# Altium project Oryecto_test.PrjPcb
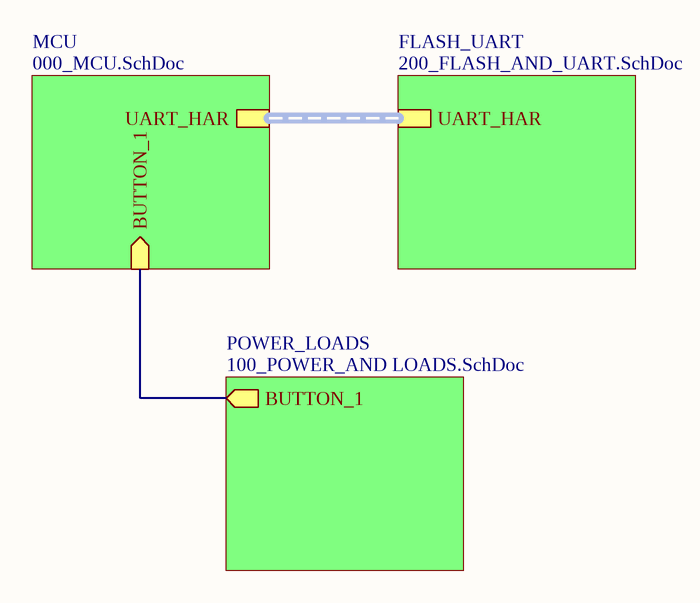
[diagram p0: Main.SchDoc]
4 sheets, 39 parts. Net scope: hierarchical (ports join the sheet entries above them; power ports are global).
Board file: PCB_proyect.PcbDoc
Sheets:
  Main.SchDoc
    MCU = 000_MCU.SchDoc
    POWER_LOADS = 100_POWER_AND LOADS.SchDoc
    FLASH_UART = 200_FLASH_AND_UART.SchDoc

## Sheet Main.SchDoc
size A; SheetNumber: 1; SheetTotal: 4

### Sub-sheets
FLASH_UART = 200_FLASH_AND_UART.SchDoc: UART_HAR (harness UART_HAR)
MCU = 000_MCU.SchDoc: UART_HAR (harness UART_HAR), BUTTON_1 (in)
POWER_LOADS = 100_POWER_AND LOADS.SchDoc: BUTTON_1 (out)

### Nets
NetC109_1: sheet MCU/BUTTON_1, sheet POWER_LOADS/BUTTON_1

### Buses and harness runs
harness sheet FLASH_UART/UART_HAR = sheet MCU/UART_HAR

## Sheet 000_MCU.SchDoc
size A3; Organization: ORGANIZATION; Address1: ADDRESS 1; Address2: ADDRESS 2; Address3: ADDRESS 3; Address4: ADDRESS 4; Revision: -; SheetNumber: 4; SheetTotal: 4; ENG_APP_DATE: --/--/--; DSN_APP_DATE: --/--/--; CHK_APP_DATE: --/--/--
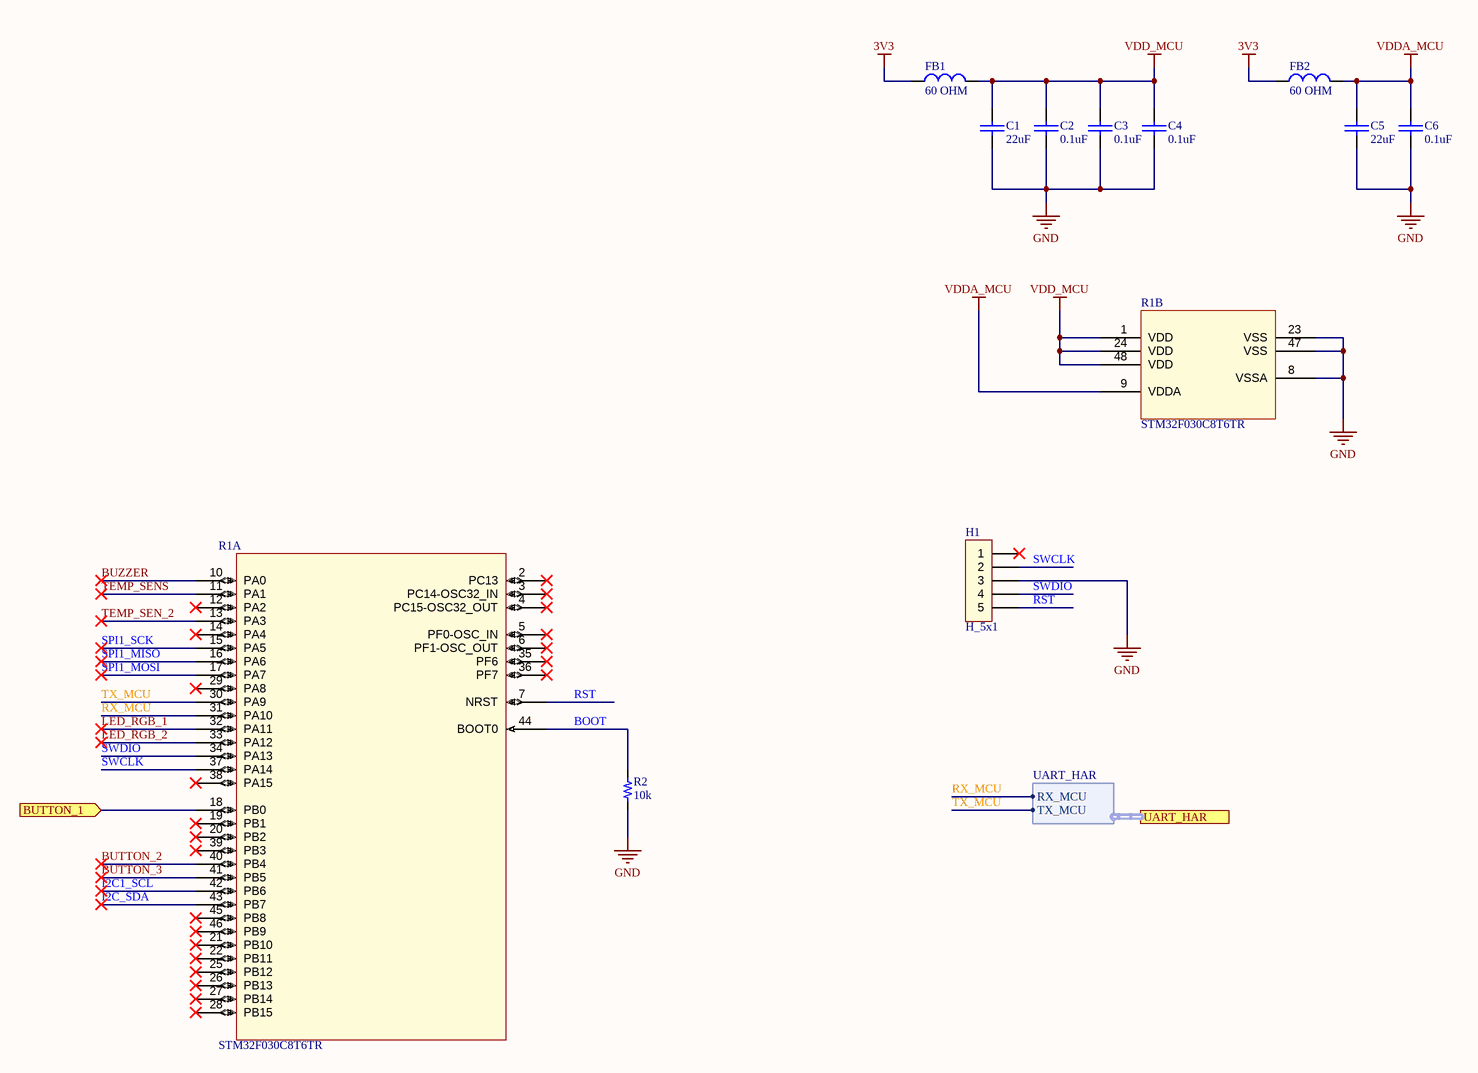
[diagram p1: 000_MCU.SchDoc]

### Parts
C1  value 22uF  [0603_cap]  (hidden comment: 22uF 6V3)
C2  value 0.1uF  [0603_cap]  (hidden comment: 0.1uF 50V)
C3  value 0.1uF  [0603_cap]  (hidden comment: 0.1uF 50V)
C4  value 0.1uF  [0603_cap]  (hidden comment: 0.1uF 50V)
C5  value 22uF  [0603_cap]  (hidden comment: 22uF 6V3)
C6  value 0.1uF  [0603_cap]  (hidden comment: 0.1uF 50V)
FB1  value 60 OHM  [0603_fb]  (hidden comment: 60OHM 2A)
FB2  value 60 OHM  [0603_fb]  (hidden comment: 60OHM 2A)
H1  H_5x1  [H_5x1_TH_100mil]  (no BOM)
R1  STM32F030C8T6TR  [LQFP48_7x7mm]  (parts A,B of 2)
R2  value 10k  [0603_res]  (hidden comment: 10k 1/10W)

### Ports
BUTTON_1 (in, see Main[2B], 100_POWER_AND LOADS[1D]), UART_HAR (harness UART_HAR, see Main[2A], 200_FLASH_AND_UART[3C])

### Harnesses
UART_HAR: RX_MCU, TX_MCU

### Nets
3V3: FB1.1 FB2.1
GND: C1.2 C2.2 C3.2 C4.2 C5.2 C6.2 H1.3 R1.8(VSSA) R1.23(VSS) R1.47(VSS) R2.1
VDD_MCU: C1.1 C2.1 C3.1 C4.1 FB1.2 R1.1(VDD) R1.24(VDD) R1.48(VDD)
VDDA_MCU: C5.1 C6.1 FB2.2 R1.9(VDDA)
BOOT: R1.44(BOOT0) R2.2
BUTTON_2: R1.40(PB4)
BUTTON_3: R1.41(PB5)
BUZZER: R1.10(PA0)
I2C1_SCL: R1.42(PB6)
I2C_SDA: R1.43(PB7)
LED_RGB_1: R1.32(PA11)
LED_RGB_2: R1.33(PA12)
RST: H1.5 R1.7(NRST)
RX_MCU: R1.31(PA10) ; port UART_HAR.RX_MCU
SPI1_MISO: R1.16(PA6)
SPI1_MOSI: R1.17(PA7)
SPI1_SCK: R1.15(PA5)
SWCLK: H1.2 R1.37(PA14)
SWDIO: H1.4 R1.34(PA13)
TEMP_SEN_2: R1.13(PA3)
TEMP_SENS: R1.11(PA1)
TX_MCU: R1.30(PA9) ; port UART_HAR.TX_MCU
NetC109_1: R1.18(PB0) ; port BUTTON_1

Not connected (* = marked no-connect by the designer): H1 1*; R1 2(PC13)* 3(PC14-OSC32_IN)* 4(PC15-OSC32_OUT)* 5(PF0-OSC_IN)* 6(PF1-OSC_OUT)* 12(PA2)* 14(PA4)* 19(PB1)* 20(PB2)* 21(PB10)* 22(PB11)* 25(PB12)* 26(PB13)* 27(PB14)* 28(PB15)* 29(PA8)* 35(PF6)* 36(PF7)* 38(PA15)* 39(PB3)* 45(PB8)* 46(PB9)*

### Notes on the sheet
- DWG. NO.
- REV.
- SHT.
- THIS DOCUMENT AND THE DATA DISCLOSED HEREIN OR HEREWITH IS THE PROPERTY OF ALTIUM LIMITED AND MAY BE FREELY DISTRIBUTED IN WHOLE. NO RIGHTS ARE RESERVED OR EXPRESS OR IMPLIED WARANTEE GIVEN.
- REVISION
- DESCRIPTION
- DATE
- APPROVED
- ENG:
- APPROVALS
- PROJECT
- DSN:
- CHK:
- REFERENCE DOCUMENTS
- PROJECT REVISION:
- TITLE
- DOCUMENT REVISION:
- DESIGN ITEM:
- BOM:
- FAB DWG:
- PCB DWG:
- ASSY DWG:
- SCALE:
- SIZE
- B
- CAGE CODE
- FILE NAME
- DWG NO.
- SHEET
- OF
- REV

### Library data of the parts
C1 C5 = Cap_22uF_0805_6V3: 6.3V 22uF X5R ±20% 0805 Multilayer Ceramic Capacitors MLCC - SMD/SMT ROHS; Manufacturer: Samsung Electro-Mechanics; Manufacturer Part Number: CL21A226MQQNNNE; Supplier 1: LCSC; Supplier Part Number 1: C5674; ComponentLink1Description: LCSC; ComponentLink1URL: https://www.lcsc.com/product-detail/Multilayer-Ceramic-Capacitors-MLCC-SMD-SMT_Samsung-Electro-Mechanics-CL21A226MQQNNNE_C5674.html
C2-C4 C6 = Cap_0.1uF_0603_50V: 50V 100nF Y5V -20%~+80% 0603 Multilayer Ceramic Capacitors MLCC - SMD/SMT ROHS; Manufacturer: Walsin Tech Corp; Manufacturer Part Number: 0603F104Z500CT; Supplier 1: LCSC; Supplier Part Number 1: C83060; ComponentLink1Description: LCSC; ComponentLink1URL: https://www.lcsc.com/product-detail/Multilayer-Ceramic-Capacitors-MLCC-SMD-SMT_Walsin-Tech-Corp-0603F104Z500CT_C83060.html
FB1 FB2 = FB_60_0603_2A: 2A 1 100mΩ 60Ω@100MHz ±25% 0603 Ferrite Beads ROHS; Manufacturer: TAI-TECH; Manufacturer Part Number: HCB1608KF-600T20; ComponentLink1Description: LCSC; ComponentLink1URL: https://www.lcsc.com/product-detail/Ferrite-Beads_TAI-TECH-HCB1608KF-600T20_C369516.html; Supplier 1: LCSC; Supplier Part Number 1: C369516
H1 = H_Male_5x1_TH_100mil: Debugging male pin; Last modified by: C-A.Serna.A; Last modified date: 20190225
R1 = IC_STM32F030C8T6TR_LQFP48_7x7MM: IC MCU 32BIT 64KB FLASH 48LQFP; Manufacturer: STMicroelectronics; Manufacturer part number: STM32F030C8T6TR; Supplier 1: LCSC; Supplier Part Number 1: C23922; ComponentLink1Description: LCSC; ComponentLink1URL: https://www.lcsc.com/product-detail/ST-Microelectronics_STMicroelectronics-STM32F030C8T6_C23922.html
R2 = Res_10k_0603_1/10W: RES SMD 10k OHM 5% 1/10W 0603; Manufacturer: FOJAN; Manufacturer Part Number: FRC0603J103TS; ComponentLink1URL: https://www.lcsc.com/product-detail/Chip-Resistor-Surface-Mount_FOJAN-FRC0603J103TS_C2930027.html; Supplier 1: LCSC; Supplier Part Number 1: C2930027; ComponentLink1Description: LCSC

## Sheet 100_POWER_AND LOADS.SchDoc
size A; SheetNumber: 2; SheetTotal: 4
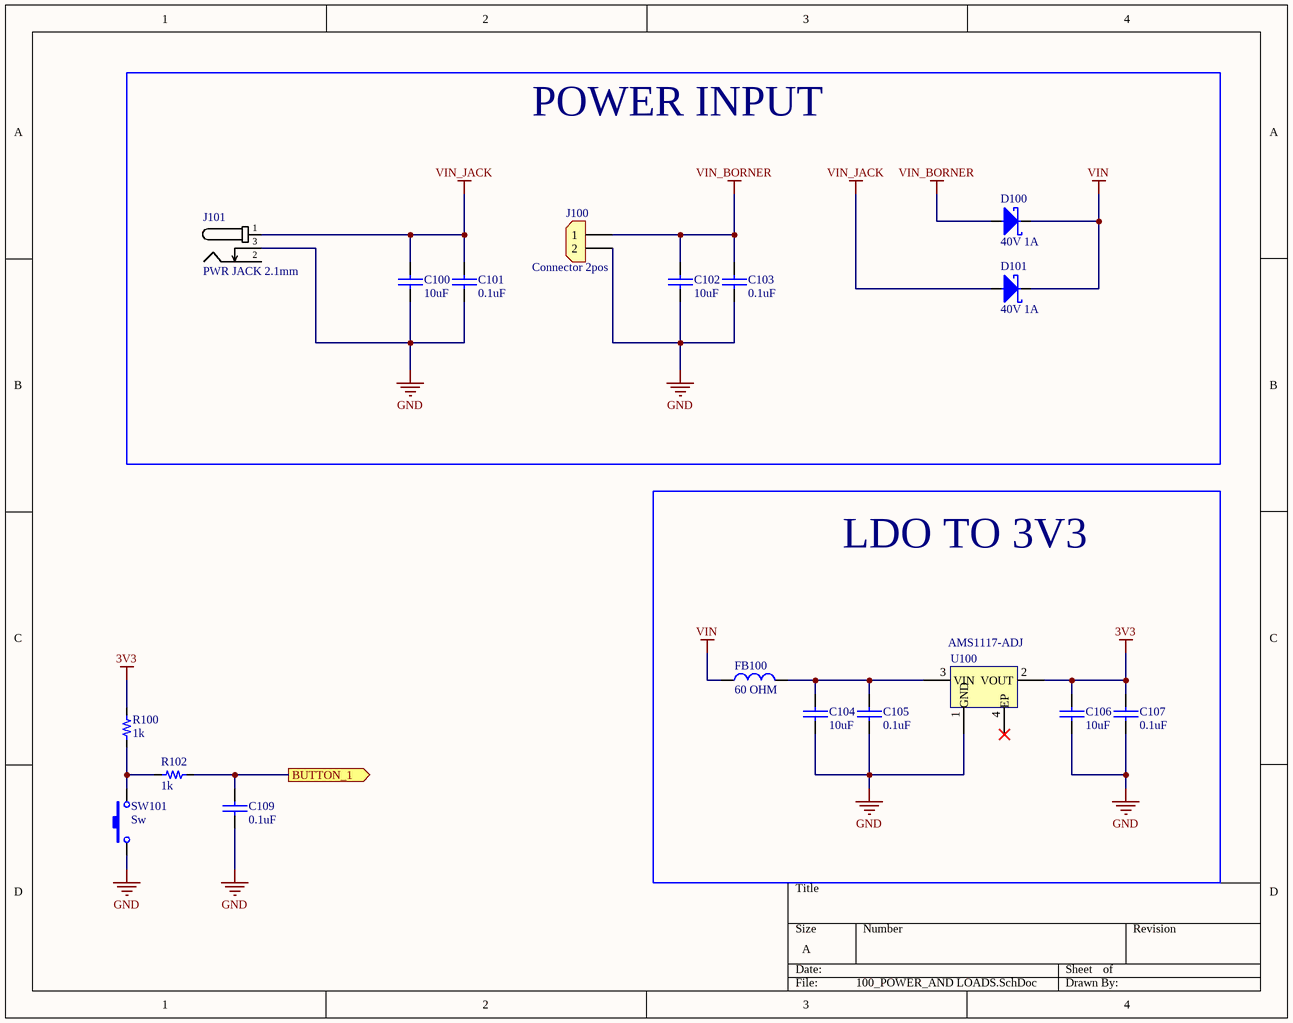
[diagram p2: 100_POWER_AND LOADS.SchDoc]

### Parts
C100  value 10uF  [0603_cap]  (hidden comment: 10uF 10V)
C101  value 0.1uF  [0603_cap]  (hidden comment: 0.1uF 50V)
C102  value 10uF  [0603_cap]  (hidden comment: 10uF 10V)
C103  value 0.1uF  [0603_cap]  (hidden comment: 0.1uF 50V)
C104  value 10uF  [0603_cap]  (hidden comment: 10uF 10V)
C105  value 0.1uF  [0603_cap]  (hidden comment: 0.1uF 50V)
C106  value 10uF  [0603_cap]  (hidden comment: 10uF 10V)
C107  value 0.1uF  [0603_cap]  (hidden comment: 0.1uF 50V)
C109  value 0.1uF  [0603_cap]  (hidden comment: 0.1uF 50V)
D100  40V 1A  [SOD_123]
D101  40V 1A  [SOD_123]
FB100  value 60 OHM  [0603_fb]  (hidden comment: 60OHM 2A)
J100  Connector 2pos  [CON_2x1_TH_5MM]
J101  PWR JACK 2.1mm  [CON_POWER_BARREL_2.1MM_3CONN]
R100  value 1k  [0603_res]  (hidden comment: 1k 1/10W)
R102  value 1k  [0603_res]  (hidden comment: 1k 1/10W)
SW101  Sw  [Sw_PUSH_4.5x4.5x5mm]
U100  AMS1117-ADJ  [SOT_223]

### Blocks framed on the sheet
POWER INPUT: C100-C103 D100 D101 J100 J101
LDO TO 3V3: C104-C107 FB100 U100

### Ports
BUTTON_1 (out, see Main[2B], 000_MCU[2C])

### Nets
3V3: C106.1 C107.1 R100.1 U100.2(VOUT)
GND: C100.2 C101.2 C102.2 C103.2 C104.2 C105.2 C106.2 C107.2 C109.2 J100.2 J101.3 SW101.1 U100.1(GND)
VIN: D100.1 D101.1 FB100.1
VIN_BORNER: C102.1 C103.1 D100.2 J100.1
VIN_JACK: C100.1 C101.1 D101.2 J101.1
NetC104_1: C104.1 C105.1 FB100.2 U100.3(VIN)
NetC109_1: C109.1 R102.2 ; port BUTTON_1
NetR100_2: R100.2 R102.1 SW101.2

Not connected (* = marked no-connect by the designer): J101 2; U100 4(EP)*

### Library data of the parts
C100 C102 C104 C106 = Cap_10uF_0603_10V: 10V 10uF X5R ±10% 0603 Multilayer Ceramic Capacitors MLCC - SMD/SMT ROHS; Manufacturer: CCTC; Manufacturer Part Number: TCC0603X5R106K100CT; Supplier 1: LCSC; Supplier Part Number 1: C380314; ComponentLink1Description: LCSC; ComponentLink1URL: https://www.lcsc.com/product-detail/Multilayer-Ceramic-Capacitors-MLCC-SMD-SMT_CCTC-TCC0603X5R106K100CT_C380314.html
C101 C103 C105 C107 = Cap_0.1uF_0603_50V: as C2 on sheet 000_MCU; Supplier 1: LCSC; Supplier Part Number 1: C83060; ComponentLink1Description: LCSC; ComponentLink1URL: https://www.lcsc.com/product-detail/Multilayer-Ceramic-Capacitors-MLCC-SMD-SMT_Walsin-Tech-Corp-0603F104Z500CT_C83060.html
C109 = Cap_0.1uF_0603_50V: 50V 100nF Y5V -20%~+80% 0603 Multilayer Ceramic Capacitors MLCC - SMD/SMT ROHS; Manufacturer: Walsin Tech Corp; Manufacturer Part Number: 0603F104Z500CT; Usage: NM; Supplier 1: LCSC; Supplier Part Number 1: C83060; ComponentLink1Description: LCSC; ComponentLink1URL: https://www.lcsc.com/product-detail/Multilayer-Ceramic-Capacitors-MLCC-SMD-SMT_Walsin-Tech-Corp-0603F104Z500CT_C83060.html
D100 D101 = D_Schottky_40V_1A_SOD_123F: DIODE SCHOTTKY 40V 1A SOD123F; Manufacturer: Shanghai Prisemi Elec; Manufacturer Part Number: PSBD1DF40V1H; Supplier 1: LCSC; Supplier Part Number 1: C110730; ComponentLink1Description: LCSC; ComponentLink1URL: https://www.lcsc.com/product-detail/Switching-Diode_Shanghai-Prisemi-Elec-PSBD1DF40V1H_C110730.html
FB100 = FB_60_0603_2A: as FB1 on sheet 000_MCU; ComponentLink1Description: LCSC; ComponentLink1URL: https://www.lcsc.com/product-detail/Ferrite-Beads_TAI-TECH-HCB1608KF-600T20_C369516.html; Supplier 1: LCSC; Supplier Part Number 1: C369516
J100 = Con_2x1_TH_5mm: 2POS 5MM; Manufacturer: JILN; Manufacturer Part Number: JL126-50002G01; Supplier 1: LCSC; Supplier Part Number 1: C394556; ComponentLink1Description: Digi-Key; ComponentLink1URL: https://www.lcsc.com/product-detail/Screw-terminal_JILN-JL126-50002G01_C394556.html
J101 = Con_Power_Jack_2.1mm_3pins: CONN PWR JACK 2X5.5MM SOLDER; Manufacturer: HCTL; Manufacturer Part Number: HC-DC-005-2.0T; Supplier 1: LCSC; Supplier Part Number 1: C3010533; ComponentLink1Description: LCSC; ComponentLink1URL: https://www.lcsc.com/product-detail/AC-DC-Power-Connectors_HCTL-HC-DC-005-2-0T_C3010533.html
R100 R102 = Res_1k_0603_1/10W: RES SMD 1k OHM 5% 1/10W 0603; Manufacturer: FOJAN; Manufacturer Part Number: FRC0603J102 TS; ComponentLink1URL: https://www.lcsc.com/product-detail/Chip-Resistor-Surface-Mount_FOJAN-FRC0603J102-TS_C2907113.html; Supplier 1: LCSC; Supplier Part Number 1: C2907113; ComponentLink1Description: LCSC
SW101 = Sw_PUSH_4.5x4.5x5.0xmm: SWITCH TACTILE SPST-NO 0.05A 12V; Manufacturer: BZCN; Manufacturer Part Number: TSC015A05026A; Supplier 1: LCSC; Supplier Part Number 1: C2888509; Last modified by: N-A.Potosi; Last modified date: 20190222; ComponentLink1Description: LCSC; ComponentLink1URL: https://www.lcsc.com/product-detail/Tactile-Switches_BZCN-TSC015A05026A_C2888509.html
U100 = LDO_3V3_1A: 1A 70dB@(120Hz) 5mA 1.2V@1A Adjustable 1.2V~20V Positive 1 20V Output Adjustable SOT-223-3L Linear Voltage Regulators (LDO) ROHS; Manufacturer: WPMtek(Wei Pan Microelectronics); ComponentLink1Description: LCSC; ComponentLink1URL: https://www.lcsc.com/product-detail/Linear-Voltage-Regulators-LDO_WPMtek-Wei-Pan-Microelectronics-AMS1117-ADJ_C2688238.html; Supplier: LCSC; Manufacturer Part Number: AMS1117-ADJ; Supplier Part Number: C2688238

## Sheet 200_FLASH_AND_UART.SchDoc
size A; SheetNumber: 3; SheetTotal: 4
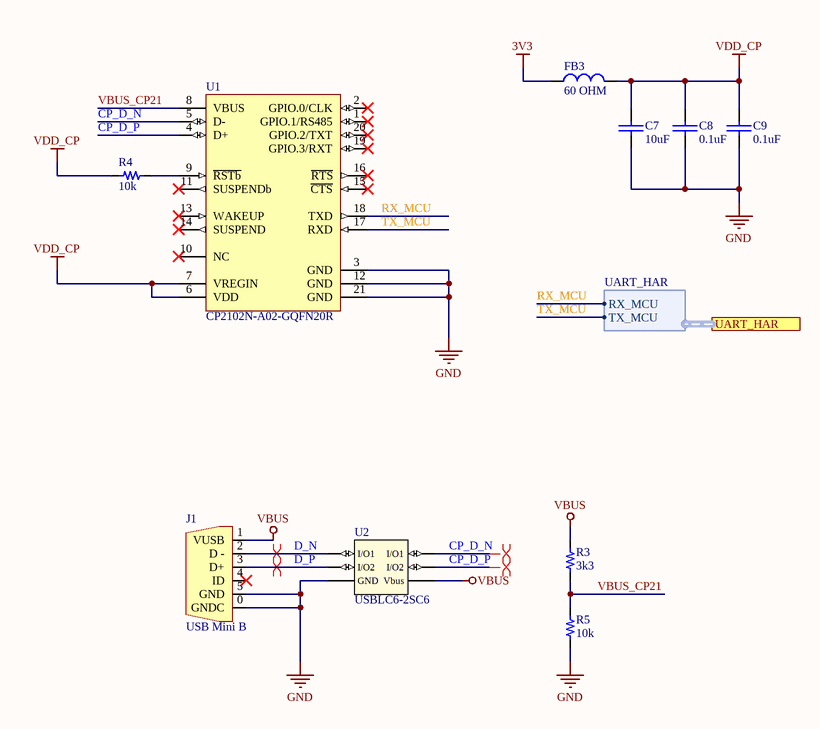
[diagram p3: 200_FLASH_AND_UART.SchDoc]

### Parts
C7  value 10uF  [0603_cap]  (hidden comment: 10uF 10V)
C8  value 0.1uF  [0603_cap]  (hidden comment: 0.1uF 50V)
C9  value 0.1uF  [0603_cap]  (hidden comment: 0.1uF 50V)
FB3  value 60 OHM  [0603_fb]  (hidden comment: 60OHM 2A)
J1  USB Mini B  [CON_5x1_SMD_miniUSB_B]
R3  value 3k3  [0603_res]  (hidden comment: 3k3 1/10W)
R4  value 10k  [0603_res]  (hidden comment: 10k 1/10W)
R5  value 10k  [0603_res]  (hidden comment: 10k 1/10W)
U1  CP2102N-A02-GQFN20R  [WFQFN_20_EP_3X3MM]
U2  USBLC6-2SC6  [SOT_23_6]

### Ports
UART_HAR (harness UART_HAR, see Main[2A], 000_MCU[6C])

### Harnesses
UART_HAR: RX_MCU, TX_MCU

### Nets
3V3: FB3.1
GND: C7.2 C8.2 C9.2 J1.0(GNDC) J1.5(GND) R5.1 U1.3(GND) U1.12(GND) U1.21(GND) U2.2(GND)
VBUS: J1.1(VUSB) R3.2 U2.5(Vbus)
VDD_CP: C7.1 C8.1 C9.1 FB3.2 R4.2 U1.6(VDD) U1.7(VREGIN)
CP_D_N: U1.5(D-) U2.6(I/O1)
CP_D_P: U1.4(D+) U2.4(I/O2)
D_N: J1.2(D_-) U2.1(I/O1)
D_P: J1.3(D+) U2.3(I/O2)
RX_MCU: U1.18(TXD) ; port UART_HAR.RX_MCU
TX_MCU: U1.17(RXD) ; port UART_HAR.TX_MCU
VBUS_CP21: R3.1 R5.2 U1.8(VBUS)
NetR4_1: R4.1 U1.9(~{RSTb})

Not connected (* = marked no-connect by the designer): J1 4(ID)*; U1 1(GPIO.1/RS485)* 2(GPIO.0/CLK)* 10(NC)* 11(SUSPENDb)* 13(WAKEUP)* 14(SUSPEND)* 15(~{CTS})* 16(~{RTS})* 19(GPIO.3/RXT)* 20(GPIO.2/TXT)*

### Layout directives
differential pair: CP_D_N, CP_D_P, D_N, D_P

### Library data of the parts
C7 = Cap_10uF_0603_10V: as C100 on sheet 100_POWER_AND LOADS; Supplier 1: LCSC; Supplier Part Number 1: C380314; ComponentLink1Description: LCSC; ComponentLink1URL: https://www.lcsc.com/product-detail/Multilayer-Ceramic-Capacitors-MLCC-SMD-SMT_CCTC-TCC0603X5R106K100CT_C380314.html
C8 C9 = Cap_0.1uF_0603_50V: as C2 on sheet 000_MCU; Supplier 1: LCSC; Supplier Part Number 1: C83060; ComponentLink1Description: LCSC; ComponentLink1URL: https://www.lcsc.com/product-detail/Multilayer-Ceramic-Capacitors-MLCC-SMD-SMT_Walsin-Tech-Corp-0603F104Z500CT_C83060.html
FB3 = FB_60_0603_2A: as FB1 on sheet 000_MCU; ComponentLink1Description: LCSC; ComponentLink1URL: https://www.lcsc.com/product-detail/Ferrite-Beads_TAI-TECH-HCB1608KF-600T20_C369516.html; Supplier 1: LCSC; Supplier Part Number 1: C369516
J1 = Con_Mini_USB_B: CONN RCPT USB2.0 MINI B SMD R/A; Manufacturer Part Number: KH-MINI-SMT-5P-Cu; Manufacturer: EDAC Inc.; ComponentLink1Description: LCSC; ComponentLink1URL: https://datasheet.lcsc.com/lcsc/2106070035_Shenzhen-Kinghelm-Elec-KH-MINI-SMT-5P-Cu_C2688795.pdf; Supplier 1: LCSC; Supplier Part Number 1: C2688795
R3 = Res_3k3_0603_1/10W: RES SMD 3k3 OHM 5% 1/10W 0603; Manufacturer: FOJAN; Manufacturer Part Number: FRC0603J332 TS; ComponentLink1URL: https://www.lcsc.com/product-detail/Chip-Resistor-Surface-Mount_FOJAN-FRC0603J332-TS_C2907140.html; Supplier 1: LCSC; Supplier Part Number 1: C2907140; ComponentLink1Description: LCSC
R4 R5 = Res_10k_0603_1/10W: as R2 on sheet 000_MCU; ComponentLink1URL: https://www.lcsc.com/product-detail/Chip-Resistor-Surface-Mount_FOJAN-FRC0603J103TS_C2930027.html; Supplier 1: LCSC; Supplier Part Number 1: C2930027; ComponentLink1Description: LCSC
U1 = IC_SGL_USB2UART-BRIDGE_20QFN: IC USB TO UART BRIDGE QFN20; Manufacturer: Silicon Labs; Manufacturer Part Number: CP2102N-A02-GQFN20R; Supplier 1: LCSC; Supplier Part Number 1: C969913; ComponentLink1Description: LCSC; ComponentLink1URL: https://www.lcsc.com/product-detail/USB-ICs_SILICON-LABS-CP2102N-A02-GQFN20R_C969913.html
U2 = TVS_5.25V_2CH_SOT_23_6: TVS DIODE 5.25V 17V SOT23-6; Manufacturer: STMicroelectronics; ComponentLink1Description: LCSC; ComponentLink1URL: https://www.lcsc.com/product-detail/ESD-Protection-Devices_STMicroelectronics-USBLC6-2SC6_C7519.html; Supplier 1: LCSC; Manufacturer Part Number: USBLC6-2SC6; Supplier Part Number 1: C7519

## Nets that join several sheets
3V3: 000_MCU (FB1.1 FB2.1), 100_POWER_AND LOADS (C106.1 C107.1 R100.1 U100.2), 200_FLASH_AND_UART (FB3.1)
GND: 000_MCU (11 pins), 100_POWER_AND LOADS (13 pins), 200_FLASH_AND_UART (10 pins)
NetC109_1: 000_MCU (R1.18), 100_POWER_AND LOADS (C109.1 R102.2)
RX_MCU: 000_MCU (R1.31), 200_FLASH_AND_UART (U1.18)
TX_MCU: 000_MCU (R1.30), 200_FLASH_AND_UART (U1.17)